# Altium schematic sheet Power.SchDoc
size A4
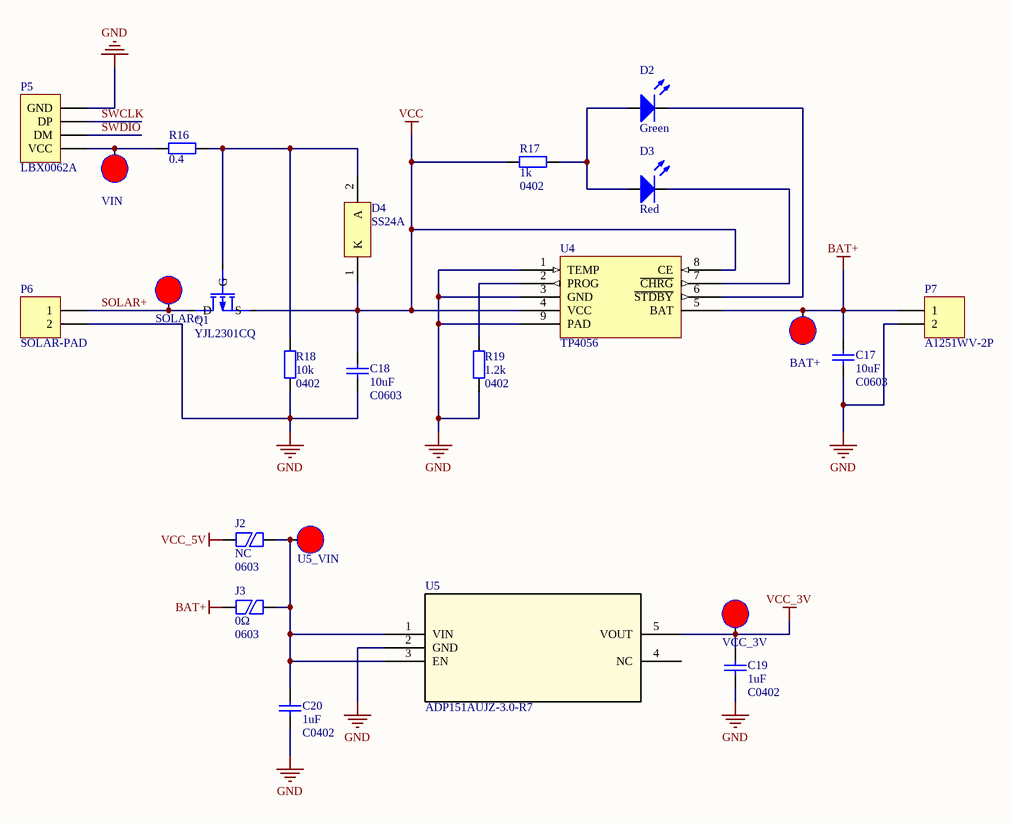
[diagram p0: Power.SchDoc]

## Parts
BAT+  TP-EMB-SMT-Single-20mil-1pin  [EMB-SMT-40MILX40MIL]  (value not drawn)
C17  10uF  PackageReference: C0603  [1608[0603]]
C18  10uF  PackageReference: C0603  [1608[0603]]
C19  1uF  PackageReference: C0402  [0402]
C20  1uF  PackageReference: C0402  [0402]
D2  Green  [0603/K]
D3  Red  [0603/K]
D4  SS24A  [ONSC-SMA-2-403D-02_V]
J2  NC  PackageReference: 0603  [1608[0603] - jumper]
J3  0Ω  PackageReference: 0603  [1608[0603] - jumper]
P5  LBX0062A  [LBX0062A]
P6  SOLAR-PAD  [SOLAR-PAD]
P7  A1251WV-2P  [A1251WV-2P]
Q1  YJL2301CQ  [SOT95P237X112-3N]
R16  0.4  [RESC3216X07N]
R17  1k  PackageReference: 0402  [RESC1005X04N]
R18  10k  PackageReference: 0402  [RESC1005X04N]
R19  1.2k  PackageReference: 0402  [RESC1005X04N]
SOLAR+  TP-EMB-SMT-Single-20mil-1pin  [EMB-SMT-40MILX40MIL]  (value not drawn)
U4  TP4056  [ESOP-9N]
U5  ADP151AUJZ-3.0-R7  [UJ_5]
U5_VIN  TP-EMB-SMT-Single-20mil-1pin  [EMB-SMT-40MILX40MIL]  (value not drawn)
VCC_3V  TP-EMB-SMT-Single-20mil-1pin  [EMB-SMT-40MILX40MIL]  (value not drawn)
VIN  TP-EMB-SMT-Single-20mil-1pin  [EMB-SMT-40MILX40MIL]  (value not drawn)

## Nets
BAT+: BAT+.1 C17.2 J3.1 P7.1 U4.5(BAT)
GND: C17.1 C18.2 C19.1 C20.1 P5.4(GND) P6.2 P7.2 R18.1 R19.1 U4.1(TEMP) U4.3(GND) U4.9(PAD) U5.2(GND)
VCC: C18.1 D4.1(K) Q1.2(S) R17.1 U4.4(VCC) U4.8(CE)
VCC_3V: C19.2 U5.5(VOUT) VCC_3V.1
VCC_5V: J2.1
SOLAR+: P6.1 Q1.3(D) SOLAR+.1
SWCLK: P5.3(DP)
SWDIO: P5.2(DM)
NetC20_2: C20.2 J2.2 J3.2 U5.1(VIN) U5.3(EN) U5_VIN.1
NetD2_A: D2.A D3.A R17.2
NetD2_K: D2.K U4.6(~{STDBY})
NetD3_K: D3.K U4.7(~{CHRG})
NetD4_2: D4.2(A) Q1.1(G) R16.2 R18.2
NetP5_1: P5.1(VCC) R16.1 VIN.1
NetR19_2: R19.2 U4.2(PROG)

Not connected (* = marked no-connect by the designer): U5 4(NC)

## Library data of the parts
BAT+ SOLAR+ U5_VIN VCC_3V VIN = TP-EMB-SMT-Single-20mil-1pin: Test Point Designed for holding a standard probe lead
C17 C18 = GRM188R61E106MA73: Capacitor(0603,X5R(EIA),10uF,DC 25V,+/-20 %) muRata; Published: 8-Jun-2000; LatestRevisionDate: 29-May-2009; LatestRevisionNote: IPC-7351 Footprint Added.; Publisher: Altium Limited; PackageDescription: Chip Capacitor; Value: 10uF
C19 C20 = GRM155R61E105KE11: Capacitor (0402,X5R,1uF,DC 25V,±10%) Murata; Published: 8-Jun-2000; LatestRevisionDate: 29-May-2009; LatestRevisionNote: IPC-7351 Footprint Added.; Publisher: Altium Limited; PackageDescription: Chip Capacitor; Value: 1uF
D2 = XL-1608SYGC: Standard 0603 SMD LED, Green, 1.6-2.2V; Published: 8-Jun-2000; LatestRevisionDate: 17-Jul-2002; LatestRevisionNote: Re-released for DXP Platform.; PackageVersion: Feb-2002; PackageReference: 0603; Publisher: Altium Limited; PackageDescription: SM LED; 2 Flat Leads; Valid: Green
D3 = XL-1608SURC: Standard 0603 SMD LED, Red, 1.6-2.2V; Published: 8-Jun-2000; LatestRevisionDate: 17-Jul-2002; LatestRevisionNote: Re-released for DXP Platform.; PackageVersion: Feb-2002; PackageReference: 0603; Publisher: Altium Limited; PackageDescription: SM LED; 2 Flat Leads; Valid: Red
D4 = SS24A: Surface Mount Schottky Rectifier, 2-Pin SMA, VRRM=40V , VF=0.5V at IF=2.0A, -55~+125°C; Manufacturer: 扬州扬杰电子科技股份有限公司; Configuration: Single; IFSM Max (A): 50; Packing: Tape and Reel; VRRM(V): 40; PackageReference: DO-214AC (SMA); PackageDescription: 2-Pin Small Molded Package, J-Bend Lead, Body 2.605 x 4.315 mm; RoHS: TRUE; Mounting Technology: Surface Mount; PartNumber: SS24A; ComponentLink1Description: Manufacturer URL; ComponentLink1URL: https://www.vishay.com; ComponentLink2Description: Datasheet; ComponentLink2URL: https://www.vishay.com/product?docid=89008; ComponentLink3Description: Package Specification; ComponentLink3URL: http://www.vishay.com/docs/88869/packaging.pdf
J2 J3 = RC0603JR-JUMP: Resistor 0603(1608) 0Ω jumper; PackageDescription: Chip Resistor, 2-Leads, Body 1.60x0.80mm, IPC Medium Density
  J2: Value: NC
  J3: Value: 0Ω
P5 = LBX0062A: PogoPinLBX0062A, 4-Pin; LatestRevisionDate: 17-Jul-2002; LatestRevisionNote: Re-released for DXP Platform.; Publisher: Altium Limited
P6 = SOLAR-PAD: Header, 2-Pin; LatestRevisionDate: 17-Jul-2002; LatestRevisionNote: Re-released for DXP Platform.; Publisher: Altium Limited
P7 = A1251WV-2P: Header, 2-Pin, 1.25mm PITCH, 180° WAFER; LatestRevisionDate: 17-Jul-2002; LatestRevisionNote: Re-released for DXP Platform.; Publisher: Altium Limited
Q1 = YJL2301CQ: P-Channel Enhancement Mode Field Effect Transistor,VDS=-20V,VGS=±10V,ID=-3.4A,VGS(th)Min=-0.4V,SOT-23; Published: 8-Jun-2000; LatestRevisionDate: 17-Jul-2002; LatestRevisionNote: Re-released for DXP Platform.; PackageVersion: 1995/1996; PackageReference: SOT23; Publisher: Altium Limited; PackageDescription: SOT23, 3-Leads, Body 2.92x2.37mm, Pitch 0.95mm, IPC Medium Density
R16 = PE1206FRF470R4L: Resistor 1206(3216) 0.4Ω ±1% 1W AUTOMOTIVE GRADEPE_L series; PackageReference: 1206; PackageDescription: Chip Resistor, 2-Leads, Body 3.20x1.60mm, IPC Medium Density; Value: 0.4
R17 = RC0402FR-071KL: Resistor 0402(1005) 1kΩ ±1%; PackageDescription: Chip Resistor, 2-Leads, Body 1.00x0.50mm, IPC Medium Density; Value: 1k
R18 = RC0402FR-0710KL: Resistor 0402(1005) 10kΩ ±1%; PackageDescription: Chip Resistor, 2-Leads, Body 1.00x0.50mm, IPC Medium Density; Value: 10k
R19 = RC0402FR-071K2L: Resistor 0402(1005) 1.2kΩ ±1%; PackageDescription: Chip Resistor, 2-Leads, Body 1.00x0.50mm, IPC Medium Density; Value: 1.2k
U4 = TP4056: 1A线性锂离子电池充电器
U5 = ADP151: The ADP151 is an ultralow noise, low dropout (LDO) linear regulator that operates from 2.2 V to 5.5 V and provides up to 200 mA of output current.; Dropout Voltage(mV): 140; RMS Niose(uV): 9; Isupply(uA): 10; Vin(V): 2.2-5.5; Iout(max)(mA): 200; Vout(V): 1.1, 1.2, 1.5, 1.8, 2.1, 2.5, 2.6, 2.75, 2.8, 2.85, 3.0, 3.3